# Altium schematic sheet 功放.SchDoc
size A4
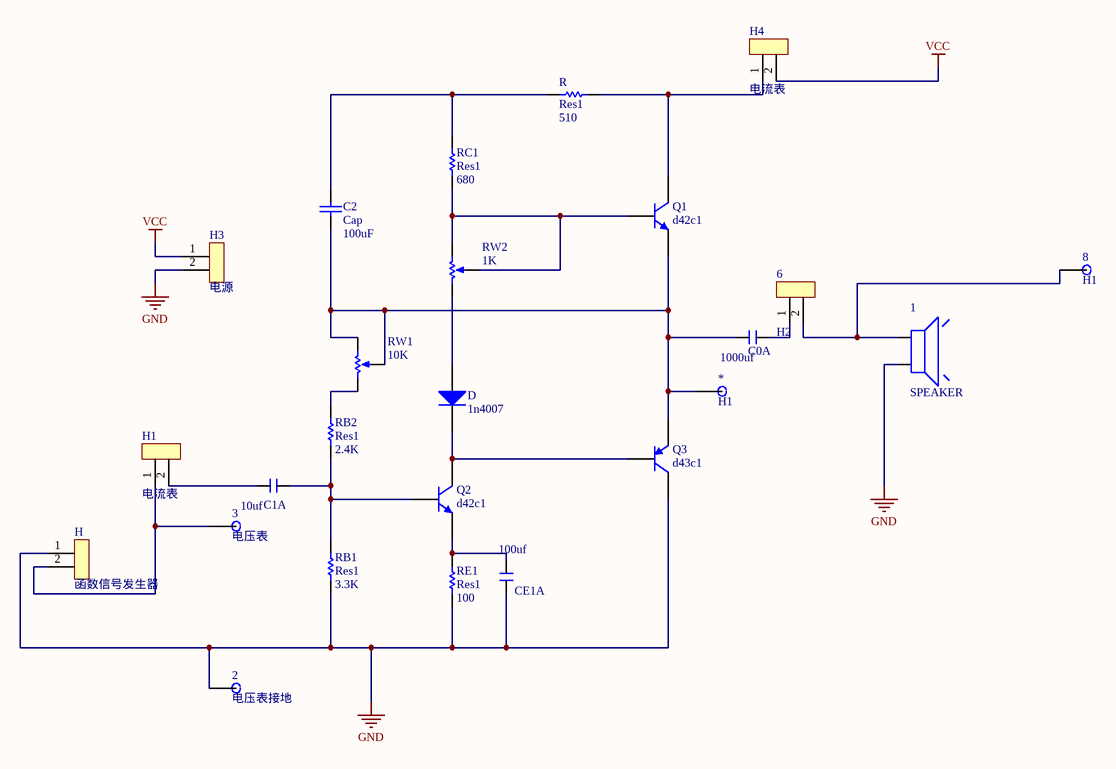
[diagram p0: 功放.SchDoc]

## Parts
1  SPEAKER  [SPEAKER]
2  电压表接地  [H1]
3  电压表  [H1]
6  H2  [H2]
8  H1  [H1]
*  H1  [H1]
C0  value 1000uf  [C2]  (hidden comment: CC1)  (part A of 2)
C1  value 10uf  [C1]  (hidden comment: CC1)  (part A of 2)
C2  Cap  value 100uF  [C1]
CE1  value 100uf  [C2]  (hidden comment: CC1)  (part A of 2)
D  1n4007  [DZ1]
H  函数信号发生器  [H2]
H1  电流表  [H2]
H3  电源  [2 Found]
H4  电流表  [H2]
Q1  d42c1  [NPN]
Q2  d42c1  [NPN]
Q3  d43c1  [NPN]
R  Res1  value 510  [RR2]
RB1  Res1  value 3.3K  [RR2]
RB2  Res1  value 2.4K  [RR2]
RC1  Res1  value 680  [RR2]
RE1  Res1  value 100  [RR2]
RW1  10K  [R_DB]
RW2  1K  [R_DB]

## Nets
GND: 1.2(-) 2.1 CE1.1 H.1 H3.2 Q3.3(C) RB1.1 RE1.1
VCC: H3.1 H4.2
Net1_1: 1.1(+) 6.2 8.1
Net3_1: 3.1 H.2 H1.1
Net6_1: 6.1 C0.2
Net*_1: *.1 C0.1 C2.1 Q1.2(E) Q3.2(E) RW1.1(TOP) RW1.2(TAP)
NetC1_1: C1.1 H1.2
NetC1_2: C1.2 Q2.1(B) RB1.2 RB2.1
NetC2_2: C2.2 R.2 RC1.2
NetCE1_2: CE1.2 Q2.2(E) RE1.2
NetD_1: D.1(A) RW2.3(BOT)
NetD_2: D.2(K) Q2.3(C) Q3.1(B)
NetH4_1: H4.1 Q1.3(C) R.1
NetQ1_1: Q1.1(B) RC1.1 RW2.1(TOP) RW2.2(TAP)
NetRB2_2: RB2.2 RW1.3(BOT)

## Library data of the parts
2 3 = H1
C0 C1 CE1 = CC1: 电容
C2 = Cap: Capacitor; Published: 8-Jun-2000; LatestRevisionDate: 17-Jul-2002; LatestRevisionNote: Re-released for DXP Platform.; PackageReference: RAD-0.3; Publisher: Altium Limited; PackageDescription: Radial Cap, Thru-Hole; 2 Leads; 0.3 in Pin Spacing
D = DD1
H H1 H3 H4 = H2
Q1 Q2 = NPN
Q3 = PNP
R RB1 RB2 RC1 RE1 = Res1: Resistor; Published: 8-Jun-2000; LatestRevisionDate: 17-Jul-2002; LatestRevisionNote: Re-released for DXP Platform.; PackageReference: AXIAL-0.3; Publisher: Altium Limited; PackageDescription: Axial Device, Thru-Hole; 2 Leads; 0.3 in Pin Spacing
RW1 RW2 = R_DB: 滑动变阻器